# Altium schematic sheet Archimajor.SchDoc: Blocks
size Letter; DocumentNumber: 1; SheetNumber: 1; SheetTotal: 11
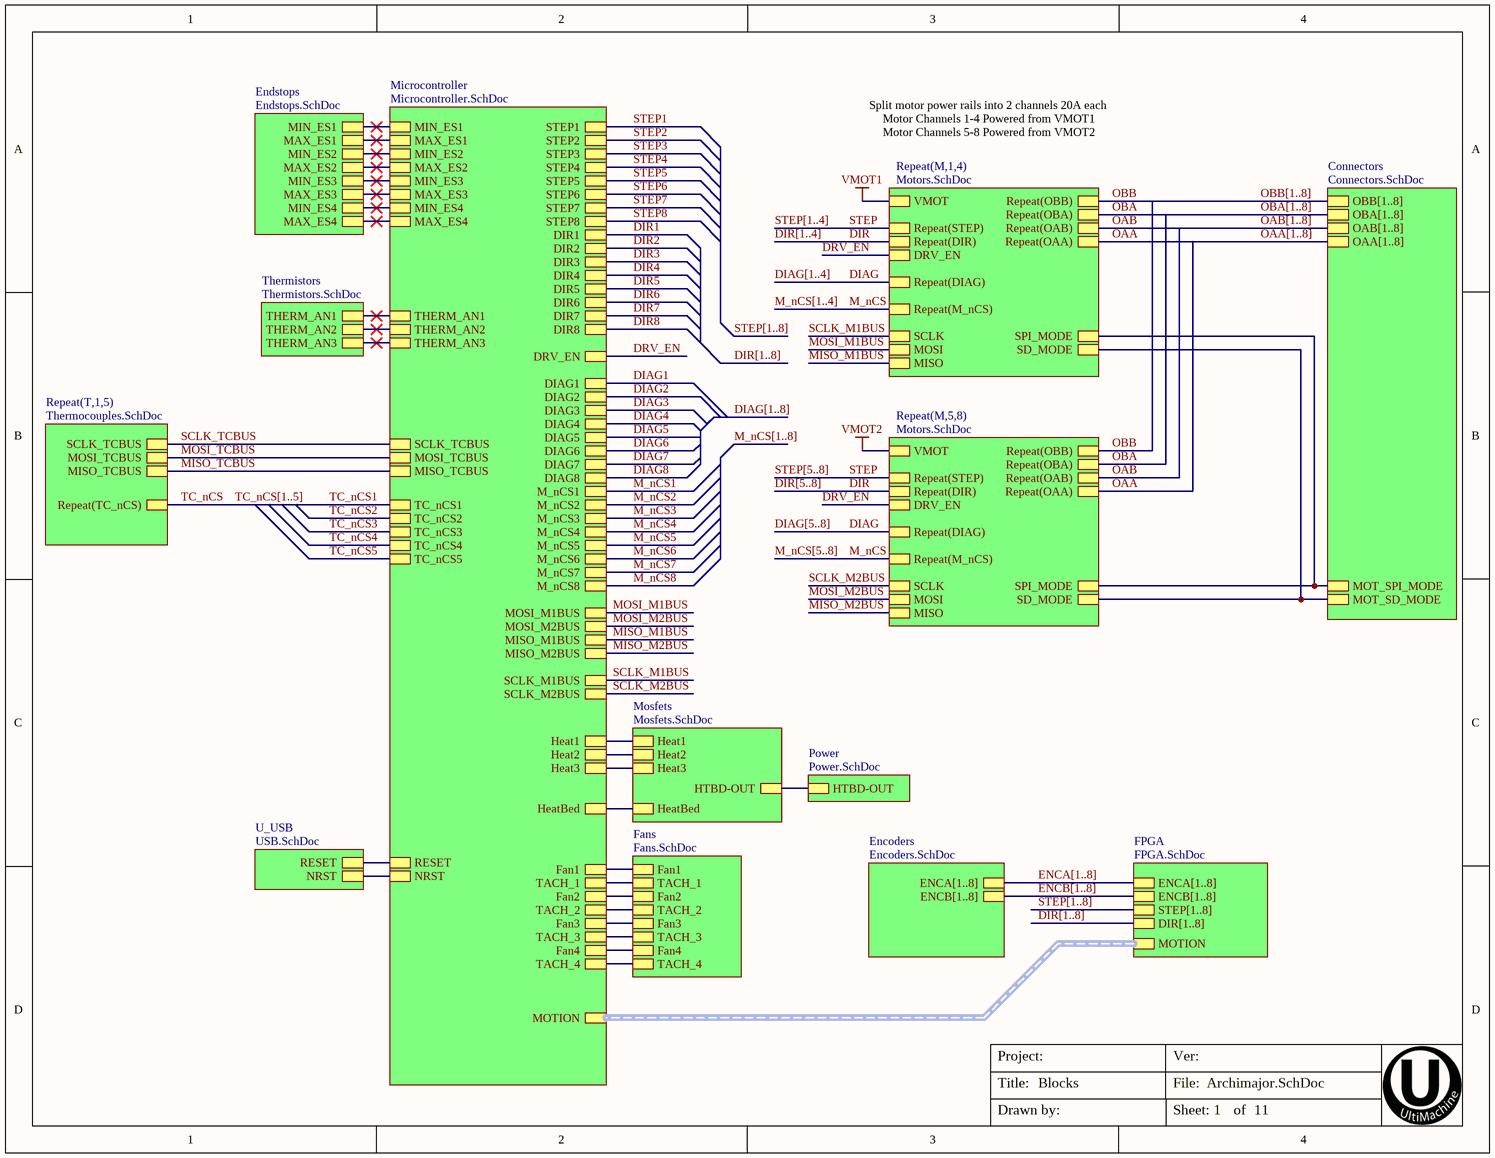
[diagram p0: Archimajor.SchDoc]

## Sub-sheets
Connectors = Connectors.SchDoc: MOT_SPI_MODE, MOT_SD_MODE, OBB[1..8], OBA[1..8], OAB[1..8], OAA[1..8]
Encoders = Encoders.SchDoc: ENCA[1..8], ENCB[1..8]
Endstops = Endstops.SchDoc: MAX_ES1, MIN_ES4, MAX_ES3, MAX_ES2, MIN_ES2, MIN_ES3, MIN_ES1, MAX_ES4
Fans = Fans.SchDoc: Fan3, TACH_3, TACH_2, Fan2, Fan4, Fan1, TACH_4, TACH_1
FPGA = FPGA.SchDoc: ENCA[1..8], ENCB[1..8], STEP[1..8], DIR[1..8], MOTION (harness MOTION)
Microcontroller = Microcontroller.SchDoc: TACH_4, THERM_AN1, THERM_AN2, THERM_AN3, TC_nCS1, MAX_ES1, MAX_ES3, MIN_ES2, MAX_ES2, MIN_ES1, MIN_ES3, HeatBed, Heat3, Heat2, Heat1, Fan2, Fan1, RESET, NRST, DRV_EN, TACH_3, TACH_1, TACH_2, TC_nCS2, DIAG1, DIR1, STEP1, M_nCS1, STEP2, M_nCS2, DIR2, DIR7, STEP3, M_nCS3, DIR3, STEP8, DIAG3, M_nCS4, STEP4, DIR4, DIAG4, M_nCS8, DIR5, STEP5, M_nCS5, DIAG5, DIR8, STEP7, DIAG6, STEP6, TC_nCS4, TC_nCS3, TC_nCS5, Fan3, Fan4, MIN_ES4, MAX_ES4, M_nCS6, DIAG7, M_nCS7, DIAG8, DIR6, MISO_M1BUS, MOSI_M1BUS, SCLK_TCBUS, SCLK_M1BUS, SCLK_M2BUS, MISO_TCBUS, MOSI_TCBUS, MOSI_M2BUS, MISO_M2BUS, DIAG2, MOTION (harness MOTION)
Mosfets = Mosfets.SchDoc: Heat2, Heat3, Heat1, HeatBed, HTBD-OUT
Power = Power.SchDoc: HTBD-OUT
Repeat(M,1,4) = Motors.SchDoc: Repeat(M_nCS), MOSI, MISO, SCLK, Repeat(STEP), Repeat(DIR), Repeat(DIAG), DRV_EN, SD_MODE, SPI_MODE, VMOT, Repeat(OBB), Repeat(OBA), Repeat(OAB), Repeat(OAA)
Repeat(M,5,8) = Motors.SchDoc: Repeat(M_nCS), MOSI, MISO, SCLK, Repeat(STEP), Repeat(DIR), Repeat(DIAG), DRV_EN, SD_MODE, SPI_MODE, VMOT, Repeat(OBB), Repeat(OBA), Repeat(OAB), Repeat(OAA)
Repeat(T,1,5) = Thermocouples.SchDoc: MISO_TCBUS, MOSI_TCBUS, SCLK_TCBUS, Repeat(TC_nCS)
Thermistors = Thermistors.SchDoc: THERM_AN3, THERM_AN1, THERM_AN2
U_USB = USB.SchDoc: NRST, RESET

## Nets
VMOT1: sheet Repeat(M,1,4)/VMOT
VMOT2: sheet Repeat(M,5,8)/VMOT
DIAG: sheet Repeat(M,1,4)/Repeat(DIAG), sheet Repeat(M,5,8)/Repeat(DIAG)
DIAG1: sheet Microcontroller/DIAG1
DIAG2: sheet Microcontroller/DIAG2
DIAG3: sheet Microcontroller/DIAG3
DIAG4: sheet Microcontroller/DIAG4
DIAG5: sheet Microcontroller/DIAG5
DIAG6: sheet Microcontroller/DIAG6
DIAG7: sheet Microcontroller/DIAG7
DIAG8: sheet Microcontroller/DIAG8
DIR: sheet Repeat(M,1,4)/Repeat(DIR), sheet Repeat(M,5,8)/Repeat(DIR)
DIR1: sheet Microcontroller/DIR1
DIR2: sheet Microcontroller/DIR2
DIR3: sheet Microcontroller/DIR3
DIR4: sheet Microcontroller/DIR4
DIR5: sheet Microcontroller/DIR5
DIR6: sheet Microcontroller/DIR6
DIR7: sheet Microcontroller/DIR7
DIR8: sheet Microcontroller/DIR8
DRV_EN: sheet Repeat(M,1,4)/DRV_EN, sheet Microcontroller/DRV_EN, sheet Repeat(M,5,8)/DRV_EN
M_nCS: sheet Repeat(M,1,4)/Repeat(M_nCS), sheet Repeat(M,5,8)/Repeat(M_nCS)
M_nCS1: sheet Microcontroller/M_nCS1
M_nCS2: sheet Microcontroller/M_nCS2
M_nCS3: sheet Microcontroller/M_nCS3
M_nCS4: sheet Microcontroller/M_nCS4
M_nCS5: sheet Microcontroller/M_nCS5
M_nCS6: sheet Microcontroller/M_nCS6
M_nCS7: sheet Microcontroller/M_nCS7
M_nCS8: sheet Microcontroller/M_nCS8
MISO_M1BUS: sheet Repeat(M,1,4)/MISO, sheet Microcontroller/MISO_M1BUS
MISO_M2BUS: sheet Microcontroller/MISO_M2BUS, sheet Repeat(M,5,8)/MISO
MISO_TCBUS: sheet Microcontroller/MISO_TCBUS, sheet Repeat(T,1,5)/MISO_TCBUS
MOSI_M1BUS: sheet Repeat(M,1,4)/MOSI, sheet Microcontroller/MOSI_M1BUS
MOSI_M2BUS: sheet Microcontroller/MOSI_M2BUS, sheet Repeat(M,5,8)/MOSI
MOSI_TCBUS: sheet Microcontroller/MOSI_TCBUS, sheet Repeat(T,1,5)/MOSI_TCBUS
OAA: sheet Repeat(M,1,4)/Repeat(OAA), sheet Repeat(M,5,8)/Repeat(OAA)
OAB: sheet Repeat(M,1,4)/Repeat(OAB), sheet Repeat(M,5,8)/Repeat(OAB)
OBA: sheet Repeat(M,1,4)/Repeat(OBA), sheet Repeat(M,5,8)/Repeat(OBA)
OBB: sheet Repeat(M,1,4)/Repeat(OBB), sheet Repeat(M,5,8)/Repeat(OBB)
SCLK_M1BUS: sheet Repeat(M,1,4)/SCLK, sheet Microcontroller/SCLK_M1BUS
SCLK_M2BUS: sheet Microcontroller/SCLK_M2BUS, sheet Repeat(M,5,8)/SCLK
SCLK_TCBUS: sheet Microcontroller/SCLK_TCBUS, sheet Repeat(T,1,5)/SCLK_TCBUS
STEP: sheet Repeat(M,1,4)/Repeat(STEP), sheet Repeat(M,5,8)/Repeat(STEP)
STEP1: sheet Microcontroller/STEP1
STEP2: sheet Microcontroller/STEP2
STEP3: sheet Microcontroller/STEP3
STEP4: sheet Microcontroller/STEP4
STEP5: sheet Microcontroller/STEP5
STEP6: sheet Microcontroller/STEP6
STEP7: sheet Microcontroller/STEP7
STEP8: sheet Microcontroller/STEP8
TC_nCS: sheet Repeat(T,1,5)/Repeat(TC_nCS)
TC_nCS1: sheet Microcontroller/TC_nCS1
TC_nCS2: sheet Microcontroller/TC_nCS2
TC_nCS3: sheet Microcontroller/TC_nCS3
TC_nCS4: sheet Microcontroller/TC_nCS4
TC_nCS5: sheet Microcontroller/TC_nCS5
(unnamed): sheet Repeat(M,1,4)/SD_MODE, sheet Connectors/MOT_SD_MODE, sheet Repeat(M,5,8)/SD_MODE
(unnamed): sheet Repeat(M,1,4)/SPI_MODE, sheet Connectors/MOT_SPI_MODE, sheet Repeat(M,5,8)/SPI_MODE
(unnamed): sheet Mosfets/Heat2, sheet Microcontroller/Heat2
(unnamed): sheet Mosfets/Heat3, sheet Microcontroller/Heat3
(unnamed): sheet Mosfets/Heat1, sheet Microcontroller/Heat1
(unnamed): sheet Mosfets/HeatBed, sheet Microcontroller/HeatBed
(unnamed): sheet Mosfets/HTBD-OUT, sheet Power/HTBD-OUT
(unnamed): sheet Thermistors/THERM_AN3, sheet Microcontroller/THERM_AN3
(unnamed): sheet Thermistors/THERM_AN1, sheet Microcontroller/THERM_AN1
(unnamed): sheet Thermistors/THERM_AN2, sheet Microcontroller/THERM_AN2
(unnamed): sheet Fans/Fan3, sheet Microcontroller/Fan3
(unnamed): sheet Fans/TACH_3, sheet Microcontroller/TACH_3
(unnamed): sheet Fans/TACH_2, sheet Microcontroller/TACH_2
(unnamed): sheet Fans/Fan2, sheet Microcontroller/Fan2
(unnamed): sheet Fans/Fan4, sheet Microcontroller/Fan4
(unnamed): sheet Fans/Fan1, sheet Microcontroller/Fan1
(unnamed): sheet Fans/TACH_4, sheet Microcontroller/TACH_4
(unnamed): sheet Fans/TACH_1, sheet Microcontroller/TACH_1
(unnamed): sheet Endstops/MAX_ES1, sheet Microcontroller/MAX_ES1
(unnamed): sheet Endstops/MIN_ES4, sheet Microcontroller/MIN_ES4
(unnamed): sheet Endstops/MAX_ES3, sheet Microcontroller/MAX_ES3
(unnamed): sheet Endstops/MAX_ES2, sheet Microcontroller/MAX_ES2
(unnamed): sheet Endstops/MIN_ES2, sheet Microcontroller/MIN_ES2
(unnamed): sheet Endstops/MIN_ES3, sheet Microcontroller/MIN_ES3
(unnamed): sheet Endstops/MIN_ES1, sheet Microcontroller/MIN_ES1
(unnamed): sheet Endstops/MAX_ES4, sheet Microcontroller/MAX_ES4
(unnamed): sheet Microcontroller/RESET, sheet U_USB/RESET
(unnamed): sheet Microcontroller/NRST, sheet U_USB/NRST

## Buses and harness runs
bus DIAG[1..4]
bus DIAG[1..8]
bus DIAG[5..8]
bus DIR[1..4]
bus DIR[1..8]
bus DIR[1..8] = sheet FPGA/DIR[1..8]
bus DIR[5..8]
bus ENCA[1..8] = sheet Encoders/ENCA[1..8] = sheet FPGA/ENCA[1..8]
bus ENCB[1..8] = sheet Encoders/ENCB[1..8] = sheet FPGA/ENCB[1..8]
bus M_nCS[1..4]
bus M_nCS[1..8]
bus M_nCS[5..8]
bus OAA[1..8] = sheet Connectors/OAA[1..8]
bus OAB[1..8] = sheet Connectors/OAB[1..8]
bus OBA[1..8] = sheet Connectors/OBA[1..8]
bus OBB[1..8] = sheet Connectors/OBB[1..8]
bus STEP[1..4]
bus STEP[1..8]
bus STEP[1..8] = sheet FPGA/STEP[1..8]
bus STEP[5..8]
bus TC_nCS[1..5]
harness sheet FPGA/MOTION = sheet Microcontroller/MOTION

## Notes on the sheet
- Split motor power rails into 2 channels 20A each
- Motor Channels 1-4 Powered from VMOT1
- Motor Channels 5-8 Powered from VMOT2
- Title:
- Project:
- File:
- Ver:
- Drawn by:
- Sheet:
- of